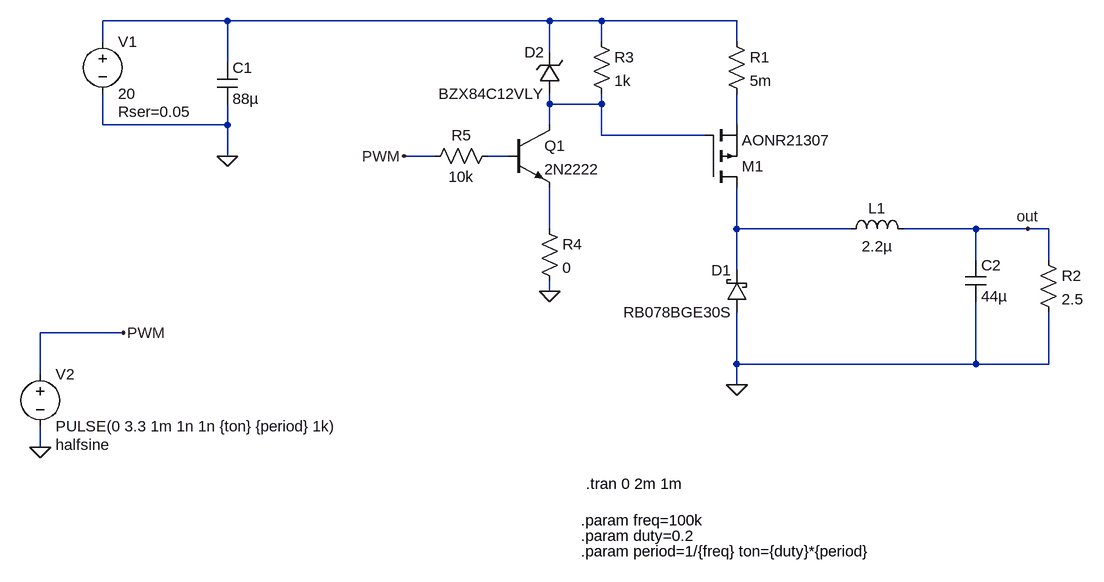
[diagram p0: schematic simple_buck.asc]
simple_buck.asc, the LTspice schematic file:
Version 4.1
SHEET 1 904 752
WIRE -592 -80 -784 -80
WIRE -96 -80 -592 -80
WIRE -16 -80 -96 -80
WIRE 192 -80 -16 -80
WIRE -784 -48 -784 -80
WIRE -16 -48 -16 -80
WIRE 192 -48 192 -80
WIRE -96 -32 -96 -80
WIRE -592 -16 -592 -80
WIRE -96 48 -96 32
WIRE -16 48 -16 32
WIRE -16 48 -96 48
WIRE -784 80 -784 32
WIRE -592 80 -592 48
WIRE -592 80 -784 80
WIRE -96 80 -96 48
WIRE 192 80 192 32
WIRE -16 96 -16 48
WIRE 144 96 -16 96
WIRE -592 128 -592 80
WIRE -272 128 -320 128
WIRE -160 128 -192 128
WIRE -96 240 -96 176
WIRE 192 240 192 176
WIRE 368 240 192 240
WIRE 560 240 448 240
WIRE 640 240 560 240
WIRE 672 240 640 240
WIRE 560 288 560 240
WIRE 672 288 672 240
WIRE 192 304 192 240
WIRE -96 336 -96 320
WIRE -752 400 -880 400
WIRE 192 448 192 368
WIRE 560 448 560 352
WIRE 560 448 192 448
WIRE 672 448 672 368
WIRE 672 448 560 448
WIRE -880 464 -880 400
WIRE 192 480 192 448
WIRE -880 576 -880 544
FLAG 192 480 0
FLAG -592 128 0
FLAG -96 336 0
FLAG -880 576 0
FLAG -320 128 PWM
FLAG -752 400 PWM
FLAG 640 240 out
SYMBOL pmos 144 176 M180
SYMATTR InstName M1
SYMATTR Value AONR21307
SYMBOL res 176 -64 R0
SYMATTR InstName R1
SYMATTR Value 5m
SYMBOL schottky 208 368 R180
WINDOW 0 24 64 Left 2
WINDOW 3 24 0 Left 2
SYMATTR InstName D1
SYMATTR Value RB078BGE30S
SYMBOL ind 352 256 R270
WINDOW 0 32 56 VTop 2
WINDOW 3 5 56 VBottom 2
SYMATTR InstName L1
SYMATTR Value 2.2µ
SYMATTR SpiceLine Rser=22m
SYMBOL cap -608 -16 R0
SYMATTR InstName C1
SYMATTR Value 88µ
SYMBOL cap 544 288 R0
SYMATTR InstName C2
SYMATTR Value 44µ
SYMBOL res 656 272 R0
SYMATTR InstName R2
SYMATTR Value 2.5
SYMBOL voltage -784 -64 R0
WINDOW 123 0 0 Left 0
WINDOW 39 24 124 Left 2
SYMATTR InstName V1
SYMATTR Value 20
SYMATTR SpiceLine Rser=0.05
SYMBOL zener -80 32 R180
WINDOW 0 24 64 Left 2
WINDOW 3 24 0 Left 2
SYMATTR InstName D2
SYMATTR Value BZX84C12VLY
SYMBOL res -32 -64 R0
SYMATTR InstName R3
SYMATTR Value 1k
SYMBOL res -112 224 R0
SYMATTR InstName R4
SYMATTR Value 0
SYMBOL npn -160 80 R0
SYMATTR InstName Q1
SYMATTR Value 2N2222
SYMBOL res -176 112 R90
WINDOW 0 0 56 VBottom 2
WINDOW 3 32 56 VTop 2
SYMATTR InstName R5
SYMATTR Value 10k
SYMBOL voltage -880 448 R0
WINDOW 123 0 0 Left 0
WINDOW 39 24 124 Left 2
SYMATTR InstName V2
SYMATTR Value PULSE(0 3.3 1m 1n 1n {ton} {period} 1k)
SYMATTR SpiceLine halfsine
TEXT -40 632 Left 2 !.tran 0 2m 1m
TEXT -48 688 Left 2 !.param freq=100k
TEXT -48 712 Left 2 !.param duty=0.2
TEXT -48 736 Left 2 !.param period=1/{freq} ton={duty}*{period}

The netlist it stands for:
* simple_buck.asc
M1 N006 N002 N003 N003 AONR21307
R1 N001 N003 5m
D1 0 N006 RB078BGE30S
L1 N006 out 2.2µ Rser=22m
C1 N001 0 88µ
C2 out 0 44µ
R2 out 0 2.5
V1 N001 0 20 Rser=0.05
D2 N002 N001 BZX84C12VLY
R3 N001 N002 1k
R4 N005 0 0
Q1 N002 N004 N005 0 2N2222
R5 N004 PWM 10k
V2 PWM 0 PULSE(0 3.3 1m 1n 1n {ton} {period} 1k) halfsine
.model D D
.lib standard.dio
.model NPN NPN
.model PNP PNP
.lib standard.bjt
.model NMOS NMOS
.model PMOS PMOS
.lib standard.mos
.tran 0 2m 1m
.param freq=100k
.param duty=0.2
.param period=1/{freq} ton={duty}*{period}
.backanno
.end